# Altium schematic sheet LCD.SchDoc
size A4
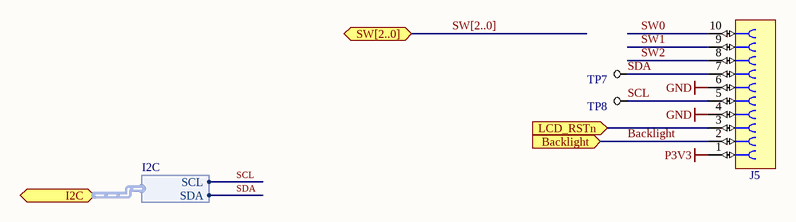
[diagram p0: LCD.SchDoc]

## Parts
J5  FFC  [WURTH_686 110 144 22]  (value not drawn)
TP7  TP  [TP]  (value not drawn)
TP8  TP  [TP]  (value not drawn)

## Ports
Backlight (in), I2C (harness I2C), LCD_RSTn (in), SW[2..0] (bidir)

## Harnesses
I2C: SCL, SDA

## Nets
GND: J5.4 J5.6
P3V3: J5.1
Backlight: J5.2 ; port Backlight
LCD_RSTn: J5.3 ; port LCD_RSTn
SCL: J5.5 TP8.1 ; port I2C.SCL
SDA: J5.7 TP7.1 ; port I2C.SDA
SW0: J5.10
SW1: J5.9
SW2: J5.8

## Buses and harness runs
bus SW[2..0] = port SW[2..0]

## Library data of the parts
J5 = WURTH_686 110 144 22: Connector 10 Female; Part Description: 10 Contacts, Pitch 1mm, SMT Connector, ZIF Horizontal Bottom Contact WR-FPC; Manufacturer: WURTH ELEKTRONIK; PressFit: No; Part Number: WURTH_686 110 144 22; Component Kind: Standard; Component Type: Standard; Pin Count: 10; Family: FFC; Mounted: Yes; Socket: No; SMD: Yes; Sense: No; Status: None; Manufacturer Part Number: 686 110 144 22; ComponentHeight: 3.15mm; HelpURL: \\cern.ch\dfs\Applications\Altium\Datasheets\WURTH_686 110 144 22.pdf; Author: CERN DEM JMW; CreateDate: 06.08.2015; LatestRevisionDate: 06.08.2015
TP7 TP8 = TP: Testpoint